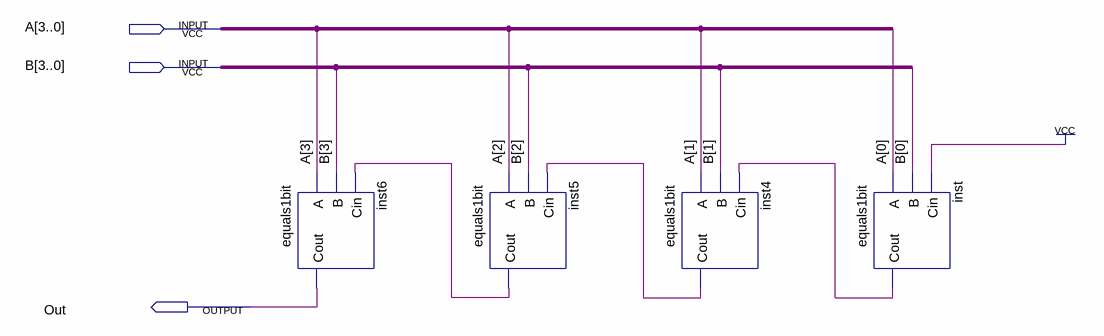
[diagram p0: schematic sheet]
// Quartus schematic equals4bit.bdf as structural Verilog: 4 symbols, 3 pins
module equals4bit (
  input  [3:0] A,
  input  [3:0] B,
  output Out
);

  wire inst4_cout, inst5_cout, inst_cout;

  equals1bit inst6 (.A(A[3]), .B(B[3]), .Cin(inst5_cout), .Cout(Out));
  equals1bit inst5 (.A(A[2]), .B(B[2]), .Cin(inst4_cout), .Cout(inst5_cout));
  equals1bit inst4 (.A(A[1]), .B(B[1]), .Cin(inst_cout), .Cout(inst4_cout));
  equals1bit inst (.A(A[0]), .B(B[0]), .Cin(1'b1), .Cout(inst_cout));
endmodule
